# Altium schematic sheet Amplifier.SchDoc
size 266 x 190 mm; SheetNumber: 2; SheetTotal: 3
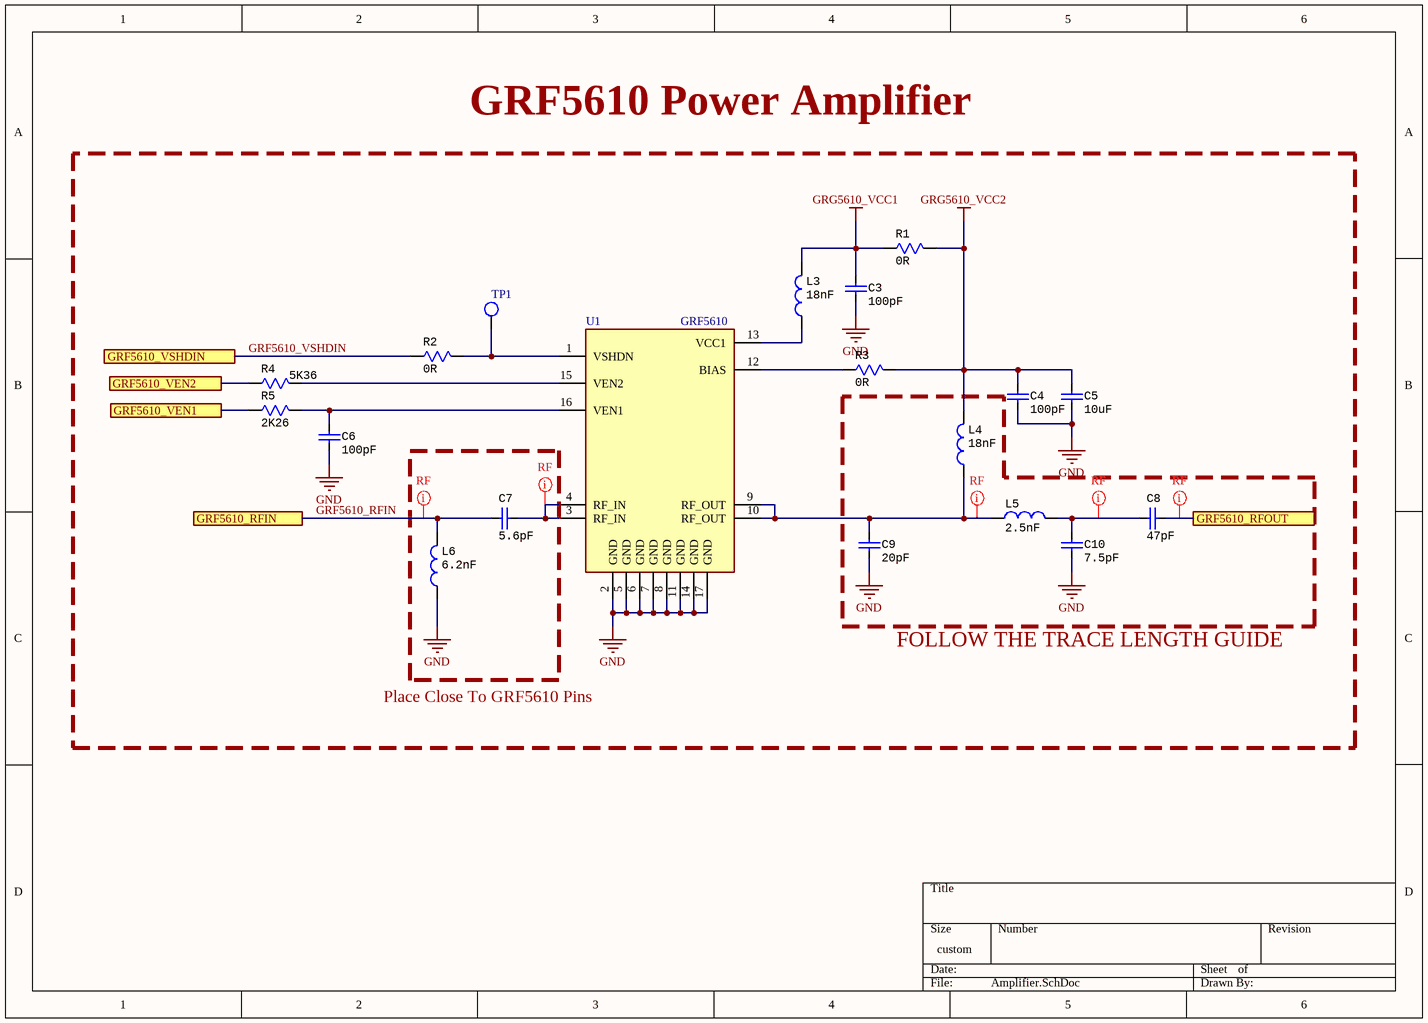
[diagram p0: Amplifier.SchDoc]

## Parts
C3  100pF  [CAP Ceramic SMD 0402]
C4  100pF  [CAP Ceramic SMD 0402]
C5  10uF  [CAP Ceramic SMD 0402]
C6  100pF  [CAP Ceramic SMD 0402]
C7  5.6pF  [CAP Ceramic SMD 0402]
C8  47pF  [CAP Ceramic SMD 0402]
C9  20pF  [CAP Ceramic SMD 0402]
C10  7.5pF  [CAP Ceramic SMD 0402]
L3  18nF  [IND SMD 0603]
L4  18nF  [IND SMD 0402HP]
L5  2.5nF  [IND SMD 0402]
L6  6.2nF  [IND SMD 0402]
R1  0R  [RES SMD 0603]
R2  0R  [RES SMD 0603]
R3  0R  [RES SMD 0603]
R4  5K36  [CAP Ceramic SMD 0402]
R5  2K26  [CAP Ceramic SMD 0402]
TP1  TestPoint  [TestPoint Surface 0.8mm]  (value not drawn)  (no BOM)
U1  GRF5610  [QFN50P300X300X80-17N]

## Ports
GRF5610_RFIN (see RFOUT DaughterBoard[2B]), GRF5610_RFOUT (see RFOUT DaughterBoard[3B]), GRF5610_VEN1 (see RFOUT DaughterBoard[2B]), GRF5610_VEN2 (see RFOUT DaughterBoard[2B]), GRF5610_VSHDIN (see RFOUT DaughterBoard[2B])

## Nets
GND: C3.2 C4.2 C5.2 C6.2 C9.2 C10.2 L6.2 U1.2(GND) U1.5(GND) U1.6(GND) U1.7(GND) U1.8(GND) U1.11(GND) U1.14(GND) U1.17(GND)
GRG5610_VCC1: C3.1 L3.1 R1.1
GRG5610_VCC2: C4.1 C5.1 L4.1 R1.2 R3.2
GRF5610_RFIN: C7.1 L6.1 ; port GRF5610_RFIN
GRF5610_RFOUT: C8.2 ; port GRF5610_RFOUT
GRF5610_VEN1: R5.1 ; port GRF5610_VEN1
GRF5610_VEN2: R4.1 ; port GRF5610_VEN2
GRF5610_VSHDIN: R2.1 ; port GRF5610_VSHDIN
NetC6_1: C6.1 R5.2 U1.16(VEN1)
NetC7_2: C7.2 U1.3(RF_IN) U1.4(RF_IN)
NetC8_1: C8.1 C10.1 L5.1
NetC9_1: C9.1 L4.2 L5.2 U1.9(RF_OUT) U1.10(RF_OUT)
NetL3_2: L3.2 U1.13(VCC1)
NetR2_2: R2.2 TP1.1 U1.1(VSHDN)
NetR3_1: R3.1 U1.12(BIAS)
NetR4_2: R4.2 U1.15(VEN2)

## Layout directives
net class RF: GRF5610_RFIN, GRF5610_RFOUT, NetC7_2, NetC8_1, NetC9_1

## Notes on the sheet
- GRF5610 Power Amplifier
- Place Close To GRF5610 Pins
- FOLLOW THE TRACE LENGTH GUIDE

## Library data of the parts
C3 C4 C6 = CAP 0402 100pF 50V: CAP CER 100pF 50V C0G 0402; Manufacturer: muRata; Manufacturer Part Number: GRM1555C1H101JA01D; Tolerance: 5%; Voltage Rating: 50V; Supplier: LCSC; Supplier Part Number: C77177; Capacitance: 100pF
C5 = CAP 0402 10uF 6.3V: CAP CER 10uF 6.3V X6S; Manufacturer: muRata; Manufacturer Part Number: GRT155C80J106ME13D; Tolerance: 20%; Voltage Rating: 6.3V; Supplier: LCSC; Supplier Part Number: C20044558; Capacitance: 10uF
C7 = CAP 0402 5.6pF 50V: CAP CER 5.6pF 50V C0G 0402; Manufacturer: muRata; Manufacturer Part Number: GJM1555C1H5R6BB01D; Voltage Rating: 50V; Supplier: LCSC; Supplier Part Number: C161329; Capacitance: 5.6pF
C8 = CAP 0402 47pF 50V: CAP CER 47pF 50V C0G 0402; Manufacturer: muRata; Manufacturer Part Number: GJM1555C1H470GB01D; Tolerance: 2%; Voltage Rating: 50V; Supplier: LCSC; Supplier Part Number: C3843411; Capacitance: 47pF
C9 = CAP 0402 20pF 50V: CAP CER 20pF 50V C0G 0402; Manufacturer: muRata; Manufacturer Part Number: GJM1555C1H200GB01D; Tolerance: 2%; Voltage Rating: 6.3V; Supplier: LCSC; Supplier Part Number: C882568; Capacitance: 20pF
C10 = CAP 0402 7.5pF 50V: CAP CER 7.5pF 50V C0G 0402; Manufacturer: muRata; Manufacturer Part Number: GJM1555C1H7R5BB01D; Tolerance: 0.1 pF; Voltage Rating: 50V; Supplier: LCSC; Supplier Part Number: C497526; Capacitance: 7.5pF
L3 = IND 0603 18nH: FIXED IND 18nH 1.4A 75mΩ 0603; Manufacturer: muRata; Manufacturer Part Number: LQW18AN18NG8ZD; Supplier: LCSC; Supplier Part Number: C1329352
L4 = IND 0402 18nH: 900mA 18nH ±5% 120mΩ Wire-wound chip inductor 0402 Fixed Inductors RoHS; Manufacturer: Coilcraft; Manufacturer Part Number: 0402HP-18NXJRW; Supplier: LCSC; Supplier Part Number: C39084920
L5 = IND 0402 2.5nH: FIXED IND 2.5nH 2.1A 30mΩ 0402; Manufacturer: muRata; Manufacturer Part Number: LQW15AN2N5G80D; Supplier: LCSC; Supplier Part Number: C412267
L6 = IND 0402 6.2nH: FIXED IND 6.2nH 700mA 90mΩ 0402; Manufacturer: muRata; Manufacturer Part Number: LQW15AN6N2C00D; Supplier: LCSC; Supplier Part Number: C113118
R1-R3 = RES 0603 0R 1%: 100mW Thick Film Resistors 75V ±5% 0Ω 0603 Chip Resistor - Surface Mount ROHS; Manufacturer: YAGEO; Manufacturer Part Number: RC0603JR-070RL; Supplier: LCSC; Supplier Part Number: C95177; Value: 0R
R4 = RES 0402 5K36 1%: RES 5.36kΩ ±1% 100mW 0402; Manufacturer: PANASONIC; Manufacturer Part Number: ERJ2RKF5361X; Supplier: LCSC; Resistance: 5K36; Tolerance: 1%; Supplier Part Number: C3025674; Value: 5K36
R5 = RES 0402 2k26 0.1%: RES 2.26kΩ ±0.1% 62.5mW 0402; Manufacturer: YAGEO; Manufacturer Part Number: RT0402BRD072K26L; Supplier: LCSC; Resistance: 2K26; Tolerance: 0.1%; Supplier Part Number: C852697; Value: 2K26
U1 = GRF5610: The GRF5610 is a high gain, two-stage InGaP HBT power amplifier designed to deliver excellent P1dB, ACLR and IM3 performance over the 860 to 928 MHz band. Its exceptional native linearity makes it an ideal choice for transmitter applications that typically do not employ digital predistortion correction schemes.; Manufacture: Guerrilla RF; Supplier Part Number: *; Manufacture Part Number: GRF5610; Supplier: *